# EAGLE schematic shield (EAGLE 6.5.0)
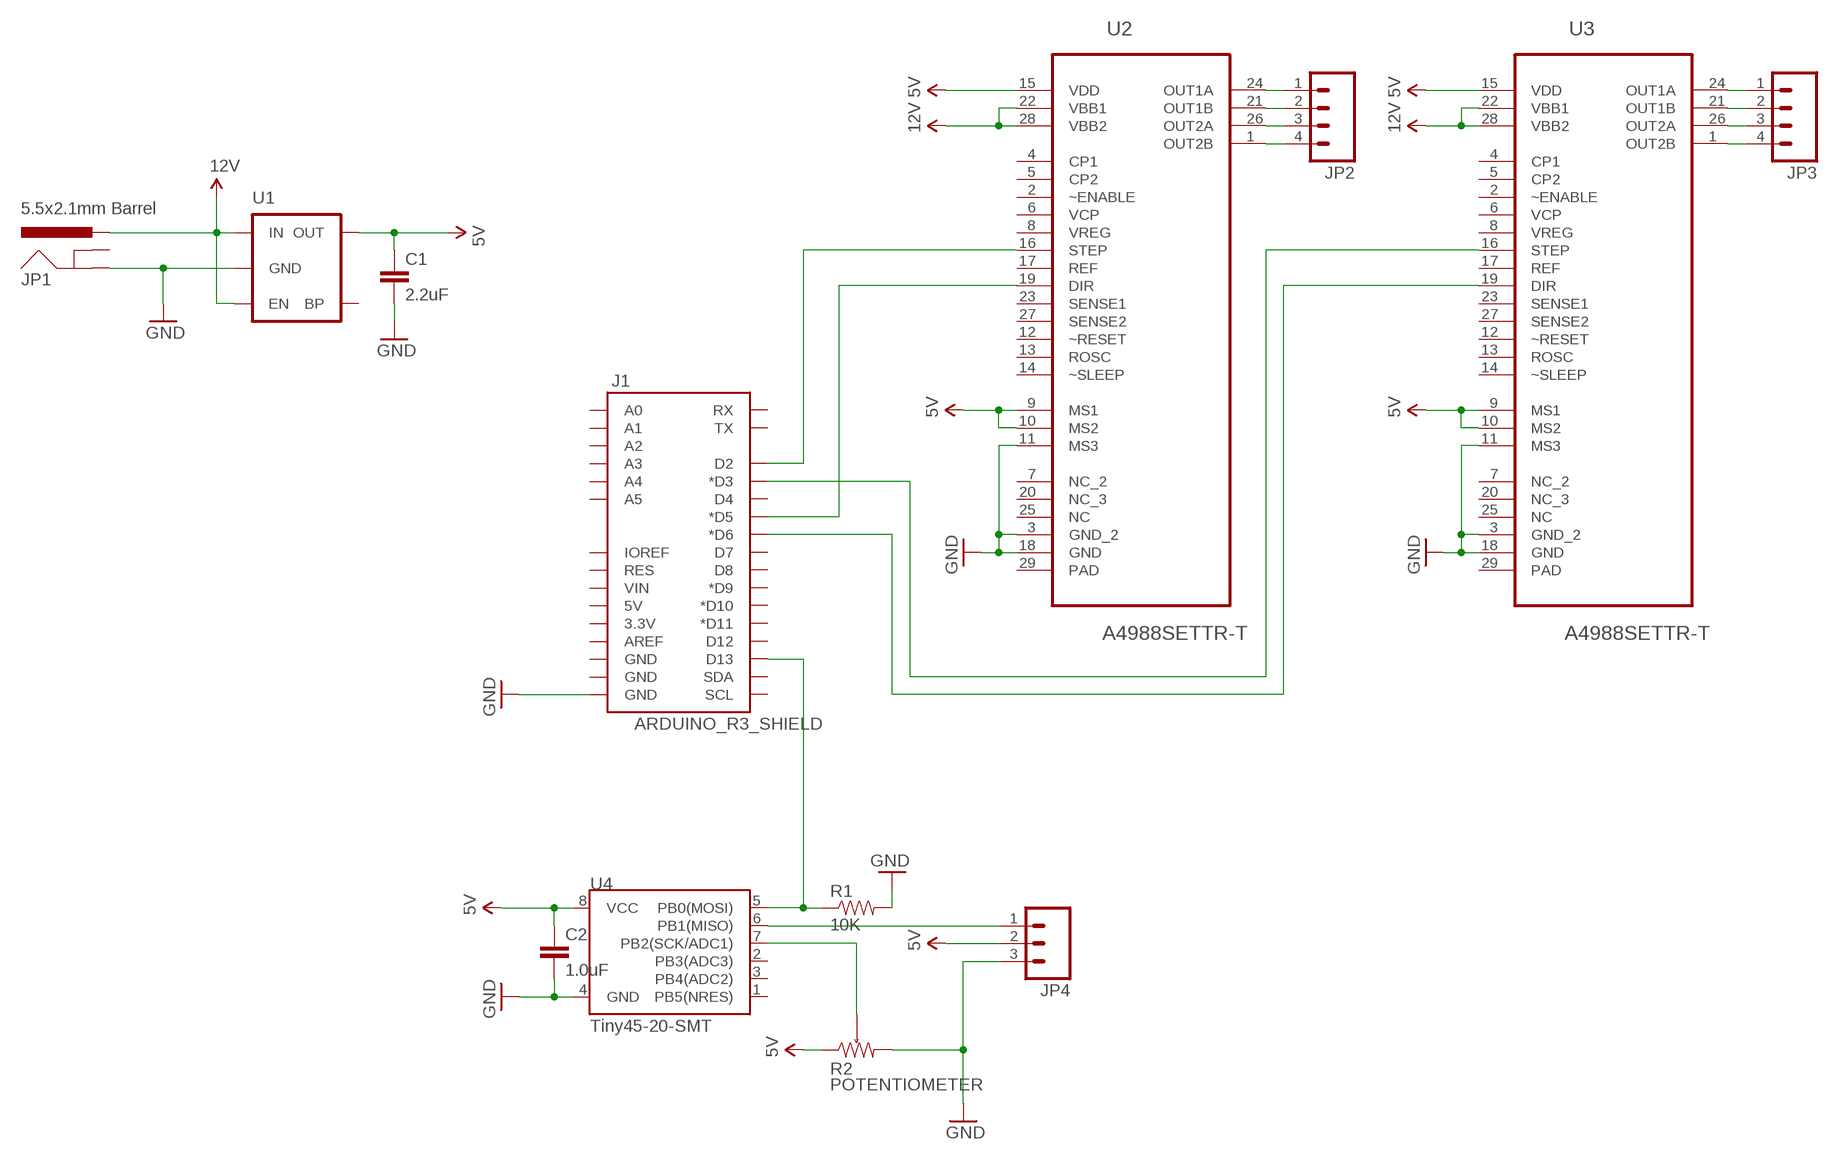
[diagram p0: schematic, sheet 1]

## Parts
C1  2.2uF  2.2UF-25V-+80/-20(0805)  [0805]
C2  1.0uF  1.0UF-25V-+80/-20(0805)  [0805]
J1  ARDUINO_R3_SHIELD  [UNO_R3_SHIELD]
JP1  5.5x2.1mm Barrel  POWER_JACKSMD  [POWER_JACK_SMD]
JP2  M04SCREW  [SCREWTERMINAL-3.5MM-4]
JP3  M04SCREW  [SCREWTERMINAL-3.5MM-4]
JP4  M03SCREW  [SCREWTERMINAL-3.5MM-3]
R1  10K  10KOHM-1/10W-1%(0603)0603  [0603-RES]
R2  POTENTIOMETER  [0603-ARV]
U1  MIC52055V  [SOT23-5]
U2  A4988SETTR-T  [QFN50P500X500X100-29N]
U3  A4988SETTR-T  [QFN50P500X500X100-29N]
U4  Tiny45-20-SMT  ATTINY45TINY45-20-SMT  [SO08-EIAJ]

## Nets
5V: C1.1 C2.1 JP4.2 R2.1 U1.5(OUT) U2.9(MS1) U2.10(MS2) U2.15(VDD) U3.9(MS1) U3.10(MS2) U3.15(VDD) U4.8(VCC)
12V: JP1.VIN0(PWR) U1.1(IN) U1.3(EN) U2.22(VBB1) U2.28(VBB2) U3.22(VBB1) U3.28(VBB2)
GND: C1.2 C2.2 J1.GND@0(GND) JP1.P$4(GND) JP4.3 R1.2 R2.2 U1.2(GND) U2.3(GND_2) U2.11(MS3) U2.18(GND) U3.3(GND_2) U3.11(MS3) U3.18(GND) U4.4(GND)
N$1: JP2.1 U2.24(OUT1A)
N$2: JP2.2 U2.21(OUT1B)
N$3: JP2.3 U2.26(OUT2A)
N$4: JP2.4 U2.1(OUT2B)
N$5: JP3.1 U3.24(OUT1A)
N$6: JP3.2 U3.21(OUT1B)
N$7: JP3.3 U3.26(OUT2A)
N$8: JP3.4 U3.1(OUT2B)
N$9: J1.D2 U2.16(STEP)
N$10: J1.D5(*D5) U2.19(DIR)
N$11: J1.D3(*D3) U3.16(STEP)
N$12: J1.D6(*D6) U3.19(DIR)
N$13: J1.D13 R1.1 U4.5(PB0(MOSI))
N$14: JP4.1 U4.6(PB1(MISO))
N$15: R2.3 R2.4 R2.5 R2.6 R2.7 R2.8 U4.7(PB2(SCK/ADC1))
Unconnected: J1.3.3V J1.5V J1.A0 J1.A1 J1.A2 J1.A3 J1.A4 J1.A5 J1.AREF J1.D4 J1.D7 J1.D8 J1.D9(*D9) J1.D10(*D10) J1.D11(*D11) J1.D12 J1.GND@1(GND) J1.GND@2(GND) J1.IOREF J1.RES J1.RX J1.SCL J1.SDA J1.TX J1.VIN JP1.GND(GNDBREAK) U1.4(BP) U2.2(~ENABLE) U2.4(CP1) U2.5(CP2) U2.6(VCP) U2.7(NC_2) U2.8(VREG) U2.12(~RESET) U2.13(ROSC) U2.14(~SLEEP) U2.17(REF) U2.20(NC_3) U2.23(SENSE1) U2.25(NC) U2.27(SENSE2) U2.29(PAD) U3.2(~ENABLE) U3.4(CP1) U3.5(CP2) U3.6(VCP) U3.7(NC_2) U3.8(VREG) U3.12(~RESET) U3.13(ROSC) U3.14(~SLEEP) U3.17(REF) U3.20(NC_3) U3.23(SENSE1) U3.25(NC) U3.27(SENSE2) U3.29(PAD) U4.1(PB5(NRES)) U4.2(PB3(ADC3)) U4.3(PB4(ADC2))

## Library data of the parts
C1 = SparkFun-Capacitors:2.2UF-25V-+80/-20(0805): CAP-11624; PROD_ID: CAP-11624
C2 = SparkFun-Capacitors:1.0UF-25V-+80/-20(0805): CAP-11625; PROD_ID: CAP-11625
J1 = SparkFun-Boards:ARDUINO_R3_SHIELD: Shield form compatible with the Arduino Uno R3.
JP1 = SparkFun-Connectors:POWER_JACK: Power Jack This is the standard 5.5mm barrel jack for power. The PTH is the most common, proven, reliable, footprint. The Slot footprint only works if the mill layer is transmitted to the PCB fab house so be warned. Mating wall wart : TOL-00298 (and others); PROD_ID: CONN-08106
JP2 JP3 = SparkFun-Connectors:M04: Header 4 Standard 4-pin 0.1" header. Use with straight break away headers (SKU : PRT-00116), right angle break away headers (PRT-00553), swiss pins (PRT-00743), machine pins (PRT-00117), and female headers (PRT-00115). Molex polarized connector foot print use with SKU : PRT-08231 with associated crimp pins and housings. 1MM SMD Version SKU: PRT-10208
JP4 = SparkFun-Connectors:M03: Header 3 Standard 3-pin 0.1" header. Use with straight break away headers (SKU : PRT-00116), right angle break away headers (PRT-00553), swiss pins (PRT-00743), machine pins (PRT-00117), and female headers (PRT-00115). Molex polarized connector foot print use with SKU : PRT-08232 with associated crimp pins and housings.
R1 = SparkFun-Resistors:10KOHM-1/10W-1%(0603): RES-00824; PROD_ID: RES-00824
R2 = SparkFun-Passives:POTENTIOMETER
U1 = SparkFun-PowerIC:MIC5205: MIC5205 150mA vreg 3.3V - VREG-00822 5V - VREG-00823; PROD_ID: VREG-00823
U2 U3 = Allegro_By_element14_Batch_1:A4988SETTR-T: DMOS Microstepping Driver with Translator and Overcurrent Protection; MPN: A4988SETTR-T; OC_FARNELL: -; OC_NEWARK: 67R9678; PACKAGE: QFN-28; SUPPLIER: Allegro
U4 = SparkFun-DigitalIC:ATTINY45: Atmel 8-pin 2/4/8kB flash uC; PROD_ID: IC-08922